# Altium schematic sheet core_corin.schdoc
size 315 x 204 mm
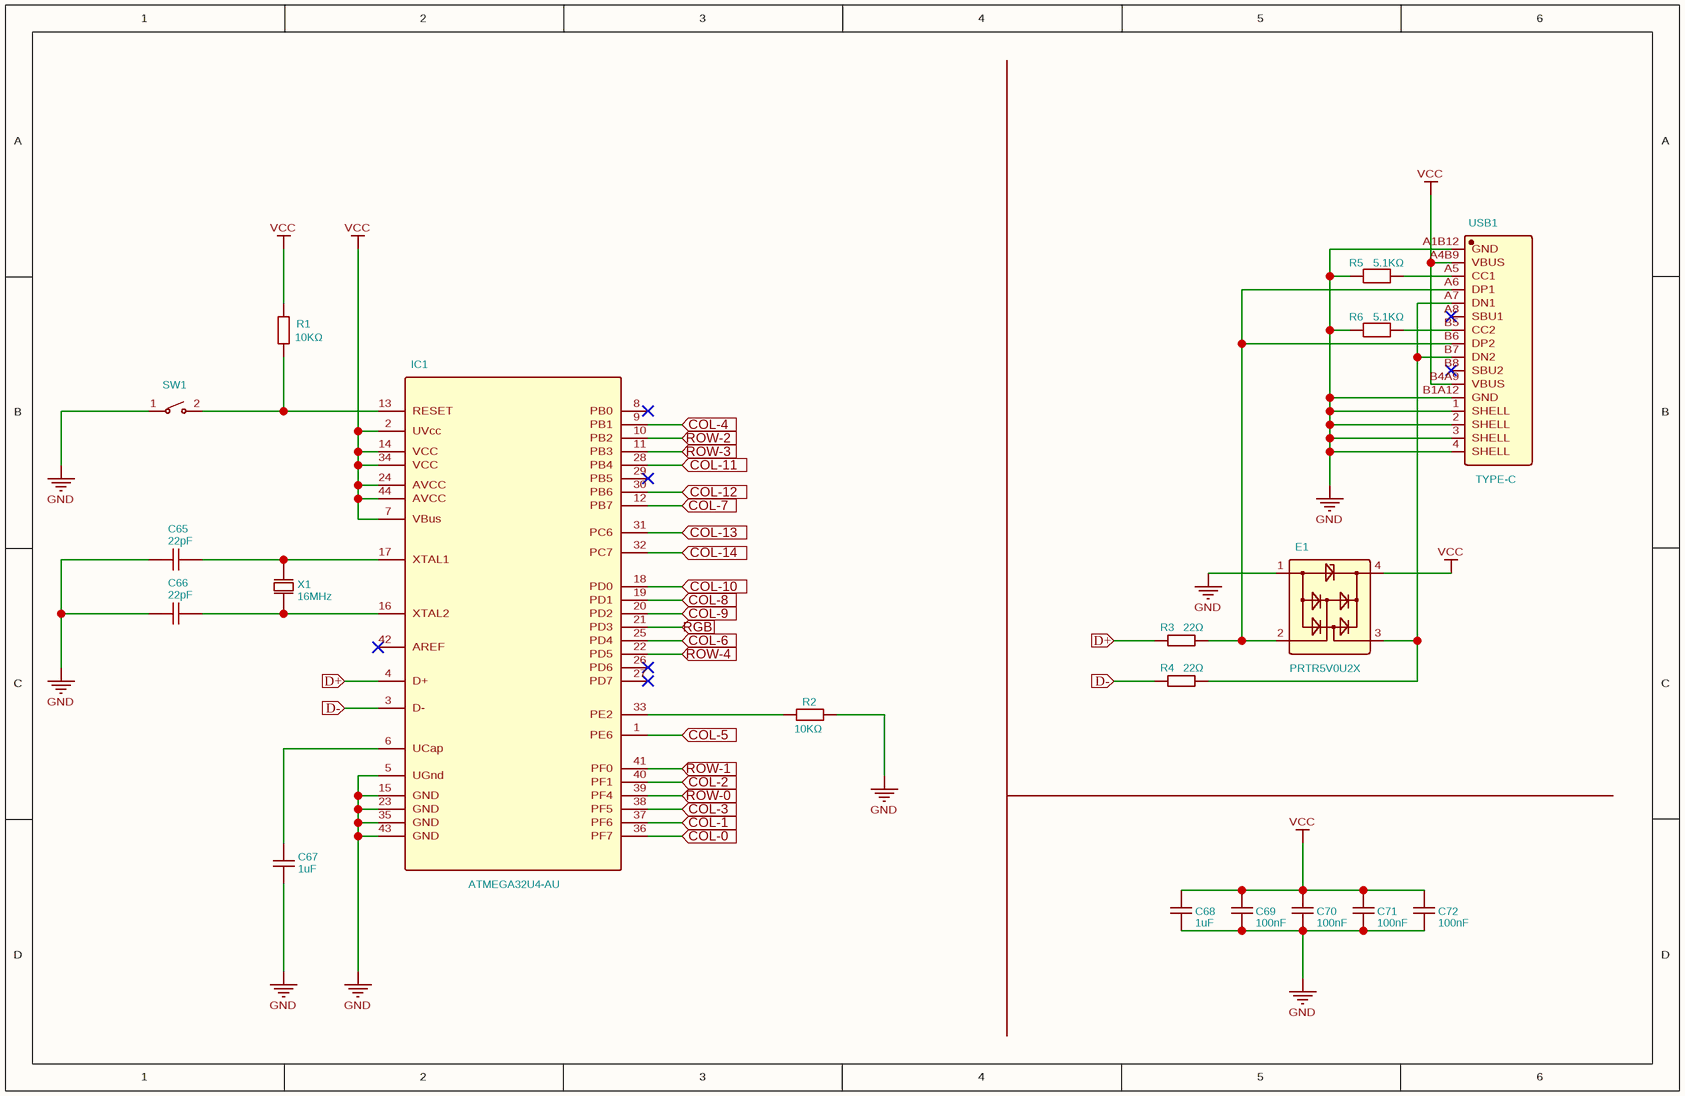
[diagram p0: core_corin.schdoc]

## Parts
C65  22pF  [C0603]
C66  22pF  [C0603]
C67  1uF  [C0603]
C68  1uF  [C0603]
C69  100nF  [C0805]
C70  100nF  [C0805]
C71  100nF  [C0805]
C72  100nF  [C0805]
E1  PRTR5V0U2X  [SOT-143_L2.9-W1.3-P1.92-LS2.3-BL]
IC1  ATMEGA32U4-AU  [QFP-44_L10.0-W10.0-P0.80-LS13.2-BL]
R1  10KΩ  [R0603]
R2  10KΩ  [R0603]
R3  22Ω  [R0603]
R4  22Ω  [R0603]
R5  5.1KΩ  [R0805]
R6  5.1KΩ  [R0805]
SW1  TS-1088R-02026  [SW-SMD_L3.9-W3.0-P4.45]  (value not drawn)
USB1  TYPE-C  [USB-C-SMD_TYPE-C16PIN]
X1  16MHz  [OSC-SMD_2P-L5.0-W3.2]

## Ports
COL-0 (in), COL-1 (in), COL-2 (in), COL-3 (in), COL-4 (in), COL-5 (in), COL-6 (in), COL-7 (in), COL-8 (in), COL-9 (in), COL-10 (in), COL-11 (in), COL-12 (in), COL-13 (in), COL-14 (in), D+ (in), D- (in), RGB (in), ROW-0 (in), ROW-1 (in), ROW-2 (in), ROW-3 (in), ROW-4 (in)

## Nets
GND: C65.2 C66.2 C67.1 C68.1 C69.1 C70.1 C71.1 C72.1 E1.1(GND) IC1.5(UGnd) IC1.15(GND) IC1.23(GND) IC1.35(GND) IC1.43(GND) R2.1 R5.1 R6.1 SW1.1 USB1.1(SHELL) USB1.2(SHELL) USB1.3(SHELL) USB1.4(SHELL) USB1.A1B12(GND) USB1.B1A12(GND)
VCC: C68.2 C69.2 C70.2 C71.2 C72.2 E1.4(VCC) IC1.2(UVcc) IC1.7(VBus) IC1.14(VCC) IC1.24(AVCC) IC1.34(VCC) IC1.44(AVCC) R1.2 USB1.A4B9(VBUS) USB1.B4A9(VBUS)
COL-0: IC1.36(PF7) ; port COL-0
COL-1: IC1.37(PF6) ; port COL-1
COL-2: IC1.40(PF1) ; port COL-2
COL-3: IC1.38(PF5) ; port COL-3
COL-4: IC1.9(PB1) ; port COL-4
COL-5: IC1.1(PE6) ; port COL-5
COL-6: IC1.25(PD4) ; port COL-6
COL-7: IC1.12(PB7) ; port COL-7
COL-8: IC1.19(PD1) ; port COL-8
COL-9: IC1.20(PD2) ; port COL-9
COL-10: IC1.18(PD0) ; port COL-10
COL-11: IC1.28(PB4) ; port COL-11
COL-12: IC1.30(PB6) ; port COL-12
COL-13: IC1.31(PC6) ; port COL-13
COL-14: IC1.32(PC7) ; port COL-14
D+: IC1.4(D+) R3.1 ; port D+
D-: IC1.3(D-) R4.1 ; port D-
RGB: IC1.21(PD3) ; port RGB
ROW-0: IC1.39(PF4) ; port ROW-0
ROW-1: IC1.41(PF0) ; port ROW-1
ROW-2: IC1.10(PB2) ; port ROW-2
ROW-3: IC1.11(PB3) ; port ROW-3
ROW-4: IC1.22(PD5) ; port ROW-4
NetC65_1: C65.1 IC1.17(XTAL1) X1.2(OSC2)
NetC66_1: C66.1 IC1.16(XTAL2) X1.1(OSC1)
NetC67_2: C67.2 IC1.6(UCap)
NetE1_2: E1.2(IO1) R3.2 USB1.A6(DP1) USB1.B6(DP2)
NetE1_3: E1.3(IO2) R4.2 USB1.A7(DN1) USB1.B7(DN2)
NetIC1_13: IC1.13(RESET) R1.1 SW1.2
NetIC1_33: IC1.33(PE2) R2.2
NetR5_2: R5.2 USB1.A5(CC1)
NetR6_2: R6.2 USB1.B5(CC2)

Not connected (* = marked no-connect by the designer): IC1 8(PB0)* 26(PD6)* 27(PD7)* 29(PB5)* 42(AREF)*; USB1 A8(SBU1)* B8(SBU2)*

## Library data of the parts
C65 C66 = 22pF: BOM_Manufacturer: SAMSUNG; BOM_Manufacturer Part: CL10C220JB81PNC; nameAlias: Capacitance; Contributor: LCSC; SMT Type: Extend; BOM_Supplier: LCSC; BOM_Supplier Part: C170132; BOM_LCSC Assembly: Yes; spicePre: C; spiceSymbolName: CL10C220JB81PNC
C67 C68 = 1uF: BOM_Manufacturer Part: CL10A105KB8NNNC; BOM_Manufacturer: SAMSUNG; nameAlias: Capacitance; SMT Type: Basic; BOM_Supplier: LCSC; BOM_LCSC Assembly: Yes; BOM_Supplier Part: C15849; spicePre: C; spiceSymbolName: CL10A105KB8NNNC
C69-C72 = 100nF: BOM_Manufacturer Part: CC0805KRX7R9BB104; BOM_Manufacturer: YAGEO; nameAlias: Capacitance; SMT Type: Basic; BOM_Supplier: LCSC; BOM_LCSC Assembly: Yes; BOM_Supplier Part: C49678; spicePre: C; spiceSymbolName: CC0805KRX7R9BB104
E1 = PRTR5V0U2X: BOM_Manufacturer: Yenji Elec; Contributor: Longnald; BOM_Supplier: LCSC; BOM_Supplier Part: C12333; BOM_Manufacturer Part: PRTR5V0U2X; spicePre: D; spiceSymbolName: PRTR5V0U2X
IC1 = ATMEGA32U4-AU: BOM_Manufacturer: MICROCHIP; SMT Type: Extend; Contributor: 亓荒; BOM_Supplier: LCSC; BOM_Manufacturer Part: ATMEGA32U4-AU; image: //image.lceda.cn/szlcsc/C44854.jpg; BOM_Supplier Part: C44854; BOM_LCSC Assembly: Yes; spicePre: U; spiceSymbolName: ATMEGA32U4-AU
R1 R2 = 10KΩ: BOM_Manufacturer: Uniroyal Elec; BOM_Manufacturer Part: 0603WAD1002T5E; nameAlias: Resistance (Ohms); Contributor: LCSC; SMT Type: Extend; BOM_Supplier: LCSC; BOM_Supplier Part: C167144; BOM_LCSC Assembly: Yes; spicePre: R; spiceSymbolName: 0603WAD1002T5E
R3 R4 = 22Ω: BOM_Manufacturer: UniOhm; BOM_Manufacturer Part: 0603WAF220JT5E; nameAlias: Resistance (Ohms); SMT Type: Basic; BOM_Supplier: LCSC; BOM_LCSC Assembly: Yes; BOM_Supplier Part: C23345; spicePre: R; spiceSymbolName: 0603WAF220JT5E
R5 R6 = 5.1KΩ: BOM_Manufacturer: Viking Tech; BOM_Manufacturer Part: CR-05JL7---5K1; nameAlias: Resistance (Ohms); Contributor: LCSC; BOM_Supplier: LCSC; BOM_Supplier Part: C416158; spicePre: R; spiceSymbolName: CR-05JL7---5K1
SW1 = TS-1088R-02026: BOM_Manufacturer: XUNPU; Contributor: LCSC; BOM_Supplier: LCSC; BOM_Supplier Part: C455280; BOM_Manufacturer Part: TS-1088R-02026; spicePre: S; spiceSymbolName: TS-1088R-02026
USB1 = TYPE-C: BOM_Manufacturer: SHOU HAN; BOM_Manufacturer Part: TYPE-C16PIN; Contributor: Longnald; BOM_Supplier: LCSC; BOM_Supplier Part: C393939; spicePre: U; spiceSymbolName: TYPE-C16PIN
X1 = 16MHz: BOM_Manufacturer: TAITIEN Elec; BOM_Manufacturer Part: XSHEELNANF-16MHZ; nameAlias: Frequency; Contributor: LCSC; BOM_Supplier: LCSC; BOM_Supplier Part: C242221; spicePre: X; spiceSymbolName: XSHEELNANF-16MHZ